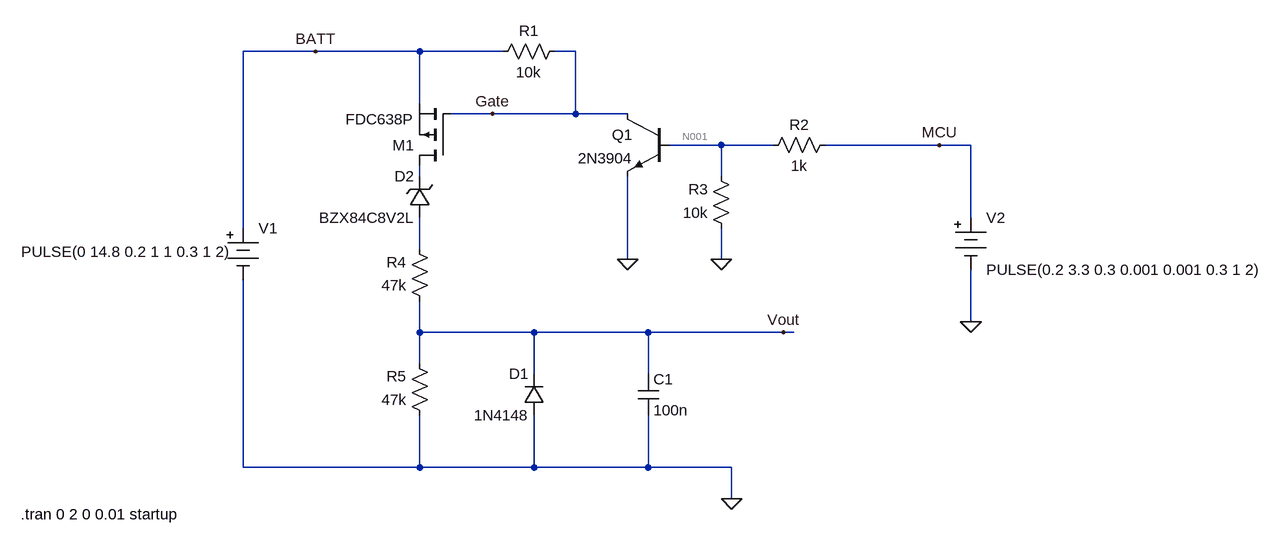
[diagram p0: schematic SelectiveDivider.asc]
SelectiveDivider.asc, the LTspice schematic file:
Version 4
SHEET 1 1304 744
WIRE -208 16 -320 16
WIRE -48 16 -208 16
WIRE 80 16 -48 16
WIRE 192 16 160 16
WIRE -48 96 -48 16
WIRE 64 112 0 112
WIRE 192 112 192 16
WIRE 192 112 64 112
WIRE 272 112 192 112
WIRE 416 160 336 160
WIRE 496 160 416 160
WIRE 752 160 576 160
WIRE 800 160 752 160
WIRE -48 208 -48 192
WIRE 416 208 416 160
WIRE 800 272 800 160
WIRE -320 288 -320 16
WIRE -48 320 -48 272
WIRE 272 336 272 208
WIRE 416 336 416 288
WIRE 800 432 800 352
WIRE -48 448 -48 400
WIRE 128 448 -48 448
WIRE 304 448 128 448
WIRE 512 448 304 448
WIRE 528 448 512 448
WIRE -48 496 -48 448
WIRE 128 512 128 448
WIRE 304 512 304 448
WIRE -320 656 -320 368
WIRE -48 656 -48 576
WIRE -48 656 -320 656
WIRE 128 656 128 576
WIRE 128 656 -48 656
WIRE 304 656 304 576
WIRE 304 656 128 656
WIRE 432 656 304 656
WIRE 432 704 432 656
FLAG 800 432 0
FLAG 432 704 0
FLAG 272 336 0
FLAG 416 336 0
FLAG 512 448 Vout
FLAG 752 160 MCU
FLAG -208 16 BATT
FLAG 64 112 Gate
SYMBOL res 176 0 R90
WINDOW 0 0 56 VBottom 2
WINDOW 3 32 56 VTop 2
SYMATTR InstName R1
SYMATTR Value 10k
SYMBOL res 592 144 R90
WINDOW 0 0 56 VBottom 2
WINDOW 3 32 56 VTop 2
SYMATTR InstName R2
SYMATTR Value 1k
SYMBOL res 432 304 R180
WINDOW 0 36 76 Left 2
WINDOW 3 36 40 Left 2
SYMATTR InstName R3
SYMATTR Value 10k
SYMBOL res -32 416 R180
WINDOW 0 36 76 Left 2
WINDOW 3 36 40 Left 2
SYMATTR InstName R4
SYMATTR Value 47k
SYMBOL res -32 592 R180
WINDOW 0 36 76 Left 2
WINDOW 3 36 40 Left 2
SYMATTR InstName R5
SYMATTR Value 47k
SYMBOL cap 288 512 R0
SYMATTR InstName C1
SYMATTR Value 100n
SYMBOL diode 144 576 R180
WINDOW 0 24 64 Left 2
WINDOW 3 24 0 Left 2
SYMATTR InstName D1
SYMATTR Value 1N4148
SYMBOL Misc\\battery -320 272 R0
WINDOW 3 -341 52 Left 2
WINDOW 123 0 0 Left 2
WINDOW 39 0 0 Left 2
SYMATTR InstName V1
SYMATTR Value PULSE(0 14.8 0.2 1 1 0.3 1 2)
SYMBOL Misc\\battery 800 256 R0
WINDOW 123 0 0 Left 2
WINDOW 39 0 0 Left 2
SYMATTR InstName V2
SYMATTR Value PULSE(0.2 3.3 0.3 0.001 0.001 0.3 1 2)
SYMBOL npn 336 112 M0
SYMATTR InstName Q1
SYMATTR Value 2N3904
SYMBOL zener -32 272 R180
WINDOW 0 24 64 Left 2
WINDOW 3 24 0 Left 2
SYMATTR InstName D2
SYMATTR Value BZX84C8V2L
SYMBOL pmos 0 192 R180
SYMATTR InstName M1
SYMATTR Value FDC638P
TEXT -662 728 Left 2 !.tran 0 2 0 0.01 startup

The netlist it stands for:
* SelectiveDivider.asc
R1 Gate BATT 10k
R2 MCU N001 1k
R3 0 N001 10k
R4 Vout N003 47k
R5 0 Vout 47k
C1 Vout 0 100n
D1 0 Vout 1N4148
V1 BATT 0 PULSE(0 14.8 0.2 1 1 0.3 1 2)
V2 MCU 0 PULSE(0.2 3.3 0.3 0.001 0.001 0.3 1 2)
Q1 Gate N001 0 0 2N3904
D2 N003 N002 BZX84C8V2L
M1 N002 Gate BATT BATT FDC638P
.model D D
.lib standard.dio
.model NPN NPN
.model PNP PNP
.lib standard.bjt
.model NMOS NMOS
.model PMOS PMOS
.lib standard.mos
.tran 0 2 0 0.01 startup
.backanno
.end

* Results of the author's LTspice run, read from the files saved beside the schematic
* Operating Point, zero values left out:
*   V(gate) = 30.03 nV
*   V(mcu) = 200 mV
*   V(n001) = 181.8 mV
*   Ic(Q1) = -3.003 pA
*   Ib(Q1) = 3.222 pA
*   I(R3) = -18.18 µA
*   I(R2) = 18.18 µA
*   I(R1) = 3.003 pA
*   I(V2) = -18.18 µA
*   I(V1) = 3.003 pA
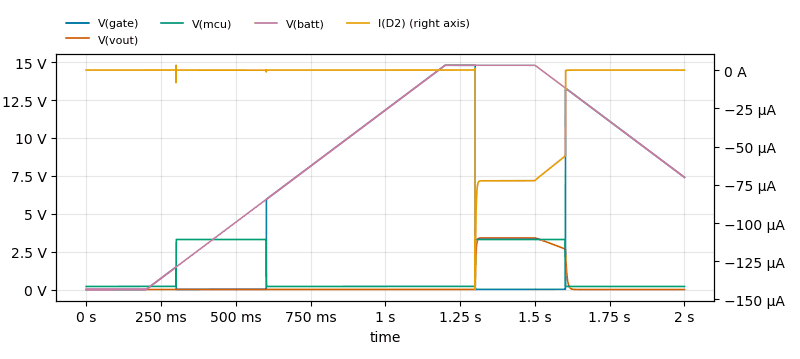
[diagram p1: Transient Analysis of SelectiveDivider.asc, plotted from the saved traces]
* Transient Analysis, 1 run:
*   V(gate): min 0 V, max 14.8 V, average 5.943 V, rms 8.196 V, last 7.4 V
*   V(vout): min -223.2 µV, max 3.402 V, average 497.6 mV, rms 1.273 V, last -16.1 µV
*   V(mcu): min 200 mV, max 3.3 V, average 1.133 V, rms 1.817 V, last 200 mV
*   V(batt): min 0 V, max 14.8 V, average 8.695 V, rms 10.09 V, last 7.4 V
*   I(D2): min -143.5 µA, max 3.188 µA, average -10.59 µA, rms 27.39 µA, last 348 pA